# Altium project bldc_v1.PrjPcb (part 1 of 2)
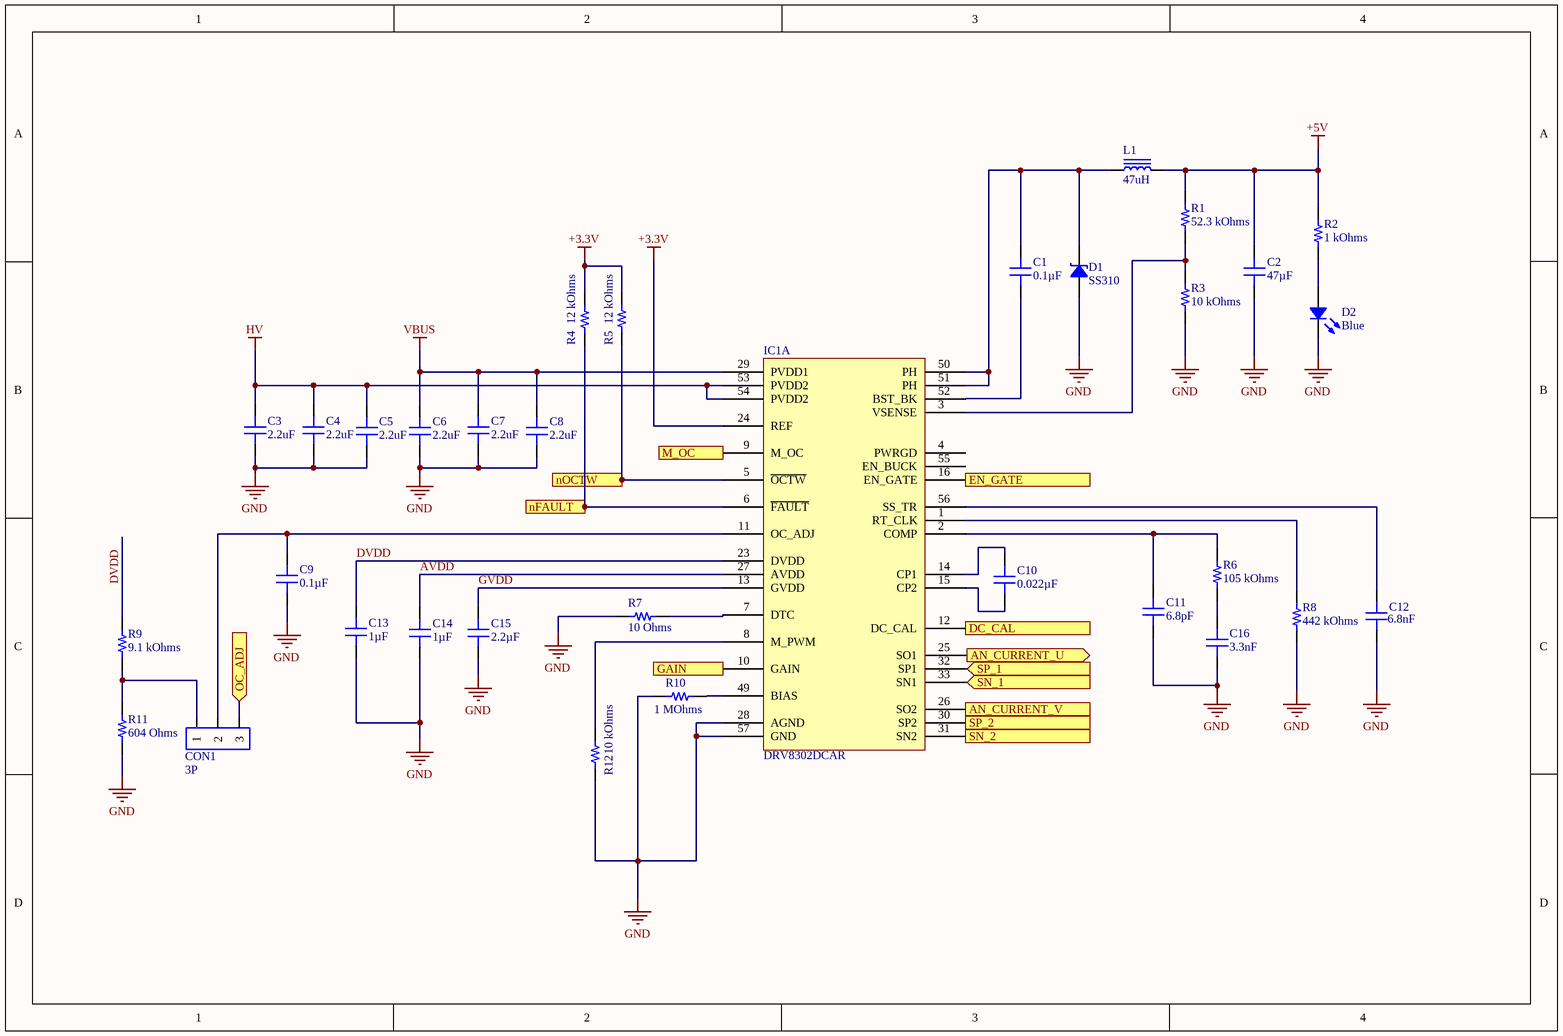
[diagram p0: driver section.SchDoc]
4 sheets, 143 parts. Net scope: flat (ports and power ports of the same name join across sheets).
Board file: main_board.PcbDoc
Sheets:
  driver section.SchDoc
  power stage.SchDoc
  controller.SchDoc
  connections.SchDoc

## Sheet driver section.SchDoc
size A4; SheetNumber: 1; SheetTotal: 4

### Parts
C1  0.1µF  [CAP 0402_1005]
C2  47µF  [CAP 1210_3225 - 2.8MM]
C3  2.2uF  [CAP FILM 1210]
C4  2.2uF  [CAP FILM 1210]
C5  2.2uF  [CAP FILM 1210]
C6  2.2uF  [CAP FILM 1210]
C7  2.2uF  [CAP FILM 1210]
C8  2.2uF  [CAP FILM 1210]
C9  0.1µF  [CAP 0402_1005]
C10  0.022µF  [CAP 0805_2012]
C11  6.8pF  [CAP 0402_1005]
C12  6.8nF  [CAP 0402_1005]
C13  1µF  [CAP 0402_1005]
C14  1µF  [CAP 0402_1005]
C15  2.2µF  [CAP 0805_2012]
C16  3.3nF  [CAP 0603_1608]
CON1  3P  [Single_THT_3P_2.54Pitch_6Height_180C]
D1  SS310  [DO214AA SMB]
D2  Blue  [LED 1206_3216 BLUE]
IC1  DRV8302DCAR  [TI HTSSOP-56 DCA]  (part A of 4)
L1  47uH  [INDP100100X45N]
R1  52.3 kOhms  [RES 1206_3216]
R2  1 kOhms  [RES 1206_3216]
R3  10 kOhms  [RES 1206_3216]
R4  12 kOhms  [RES 1206_3216]
R5  12 kOhms  [RES 1206_3216]
R6  105 kOhms  [RES 1206_3216]
R7  10 Ohms  [RES 1206_3216]
R8  442 kOhms  [RES 1206_3216]
R9  9.1 kOhms  [RES 1206_3216]
R10  1 MOhms  [RES 1206_3216]
R11  604 Ohms  [RES 1206_3216]
R12  10 kOhms  [RES 1206_3216]

### Ports
AN_CURRENT_U (out), AN_CURRENT_V (out), DC_CAL (in), EN_GATE (in), GAIN (in), M_OC (in), nFAULT (out), nOCTW (out), OC_ADJ (in), SN_1 (in), SN_2 (in), SP_1 (in), SP_2 (in)

### Nets
+3.3V: IC1.24(REF) R4.2 R5.2
+5V: C2.2 L1.2 R1.2 R2.2
GND: C2.1 C3.1 C4.1 C5.1 C6.1 C7.1 C8.1 C9.1 C11.1 C12.1 C13.1 C14.1 C15.1 C16.1 D1.1 D2.2 IC1.28(AGND) IC1.57(GND) R3.1 R7.1 R8.1 R10.2 R11.1 R12.1
HV: C3.2 C4.2 C5.2 IC1.53(PVDD2) IC1.54(PVDD2)
VBUS: C6.2 C7.2 C8.2 IC1.29(PVDD1)
AVDD: C14.2 IC1.27(AVDD)
DVDD: C13.2 IC1.23(DVDD) R9.2
GVDD: C15.2 IC1.13(GVDD)
SHUNT_1_N: IC1.32(SP1) ; port SP_1
SHUNT_1_P: IC1.33(SN1) ; port SN_1
SHUNT_2_N: IC1.30(SP2) ; port SP_2
SHUNT_2_P: IC1.31(SN2) ; port SN_2
NetC1_1: C1.1 IC1.52(BST_BK)
NetC1_2: C1.2 D1.2 IC1.50(PH) IC1.51(PH) L1.1
NetC9_2: C9.2 CON1.2 IC1.11(OC_ADJ)
NetC10_1: C10.1 IC1.15(CP2)
NetC10_2: C10.2 IC1.14(CP1)
NetC11_2: C11.2 IC1.2(COMP) R6.2
NetC12_2: C12.2 IC1.56(SS_TR)
NetC16_2: C16.2 R6.1
NetCON1_1: CON1.1 R9.1 R11.2
NetCON1_3: CON1.3 ; port OC_ADJ
NetD2_1: D2.1 R2.1
NetIC1_1: IC1.1(RT_CLK) R8.2
NetIC1_3: IC1.3(VSENSE) R1.1 R3.2
NetIC1_5: IC1.5(~{OCTW}) R5.1 ; port nOCTW
NetIC1_6: IC1.6(~{FAULT}) R4.1 ; port nFAULT
NetIC1_7: IC1.7(DTC) R7.2
NetIC1_8: IC1.8(M_PWM) R12.2
NetIC1_9: IC1.9(M_OC) ; port M_OC
NetIC1_10: IC1.10(GAIN) ; port GAIN
NetIC1_12: IC1.12(DC_CAL) ; port DC_CAL
NetIC1_16: IC1.16(EN_GATE) ; port EN_GATE
NetIC1_25: IC1.25(SO1) ; port AN_CURRENT_U
NetIC1_26: IC1.26(SO2) ; port AN_CURRENT_V
NetIC1_49: IC1.49(BIAS) R10.1

Not connected (* = marked no-connect by the designer): IC1 4(PWRGD) 55(EN_BUCK)

### Notes on the sheet
- Over Current Trip Volt=
  R2/(R1+R2)*DVDD(3.3V)
  Over Current=Vds/Rds
  Over Current Trip Current=30A

### Library data of the parts
C1 C9 = C0402C104M4RACTU: CAP CER 0.1UF 16V X7R 0402; Manufacturer: KEMET; Tolerance: ±20%; Part Number: C0402C104M4RACTU; Value: 0.1µF; Applications: Bypass, Decoupling; Capacitance: 0.1µF; ComponentLink1Description: Datasheet; ComponentLink1URL: https://api.kemet.com/component-edge/download/datasheet/C0402C104M4RACTU.pdf; ComponentLink2Description: DigiKey Link; ComponentLink2URL: http://digikey.com/product-detail/en/kemet/C0402C104M4RACTU/399-7763-1-ND/3471486; Device Package: 0402 (1005 Metric); LastUpdated: 9/2/2020 1:02:24 AM; Lifecycle Status: Active; Minimum Order: 1; Mounting Type: Surface Mount, MLCC; Operating Temperature: -55°C ~ 125°C; Package / Case: 0402 (1005 Metric); Packaging: TapeAndReel; PartId: 2095; Part Status: Active; Price: 0.02; Series: SMD Comm X7R; Size / Dimension: 0.039" L x 0.020" W (1.00mm x 0.50mm); Supplier 1: DigiKey; Supplier Part Number 1: 399-7763-1-ND; Temperature Coefficient: X7R; Thickness (Max): 0.022" (0.55mm); Voltage - Rated: 16V
C2 = GRM32EC81C476KE15L: CAP CER 47UF 16V X6S 1210; Manufacturer: Murata Electronics; Tolerance: ±10%; Part Number: GRM32EC81C476KE15L; Value: 47µF; Applications: General Purpose; Capacitance: 47µF; ComponentLink1Description: Datasheet; ComponentLink1URL: https://search.murata.co.jp/Ceramy/image/img/A01X/G101/ENG/GRM32EC81C476KE15-01.pdf; ComponentLink2Description: DigiKey Link; ComponentLink2URL: http://digikey.com/product-detail/en/murata-electronics/GRM32EC81C476KE15L/490-10531-1-ND/5026469; Device Package: 1210 (3225 Metric); LastUpdated: 9/2/2020 1:10:53 AM; Lifecycle Status: Active; Minimum Order: 1; Mounting Type: Surface Mount, MLCC; Operating Temperature: -55°C ~ 105°C; Package / Case: 1210 (3225 Metric); Packaging: TapeAndReel; PartId: 23627; Part Status: Active; Price: 0.23; Series: GRM; Size / Dimension: 0.126" L x 0.098" W (3.20mm x 2.50mm); Supplier 1: DigiKey; Supplier Part Number 1: 490-10531-1-ND; Temperature Coefficient: X6S; Thickness (Max): 0.106" (2.70mm); Voltage - Rated: 16V
C3-C8 = LDEEB2220JA0N00: CAP FILM 0.022UF 5% 100VDC 1210; Manufacturer: KEMET; Dielectric Material: Polyester, Polyethylene Naphthalate (PEN), Metallized - Stacked; Voltage Rating - AC: 63V; Voltage Rating - DC: 100V; Part Number: LDEEB2220JA0N00; Capacitance: 2.2uF; Applications: Automotive; ComponentLink1Description: Datasheet; ComponentLink1URL: https://api.kemet.com/component-edge/download/datasheet/LDEEB2220JA0N00.pdf; ComponentLink2Description: DigiKey Link; ComponentLink2URL: http://digikey.com/product-detail/en/kemet/LDEEB2220JA0N00/399-6424-1-ND/3028782; Device Package: 1210 (3225 Metric); Features: High Temperature; Height - Seated (Max): 0.059" (1.50mm); LastUpdated: 9/2/2020 1:24:46 AM; Lifecycle Status: Active; Minimum Order: 1; Mounting Type: Surface Mount; Operating Temperature: -55°C ~ 125°C; Package / Case: 1210 (3225 Metric); Packaging: TapeAndReel; Part Status: Active; Price: 0.35; Ratings: AEC-Q200; Series: LDE; Size / Dimension: 0.130" L x 0.098" W (3.30mm x 2.50mm); Supplier 1: DigiKey; Supplier Part Number 1: 399-6424-1-ND; Termination: Solder Pads; Tolerance: ±5%; Value: 2.2uF
C10 = CL21B223KCFNNNE: CAP CER 0.022UF 100V X7R 0805; Manufacturer: Samsung Electro-Mechanics; Tolerance: ±10%; Part Number: CL21B223KCFNNNE; Value: 0.022µF; Applications: General Purpose; Capacitance: 0.022µF; ComponentLink1Description: Datasheet; ComponentLink1URL: http://www.samsungsem.com/kr/support/product-search/mlcc/CL21B223KCFNNNE.jsp; ComponentLink2Description: DigiKey Link; ComponentLink2URL: http://digikey.com/product-detail/en/samsung-electro-mechanics/CL21B223KCFNNNE/1276-2942-1-ND/3891028; Device Package: 0805 (2012 Metric); LastUpdated: 9/2/2020 1:04:37 AM; Lifecycle Status: Active; Minimum Order: 1; Mounting Type: Surface Mount, MLCC; Operating Temperature: -55°C ~ 125°C; Package / Case: 0805 (2012 Metric); Packaging: TapeAndReel; PartId: 4906; Part Status: Active; Price: 0.02; Series: CL; Size / Dimension: 0.079" L x 0.049" W (2.00mm x 1.25mm); Supplier 1: DigiKey; Supplier Part Number 1: 1276-2942-1-ND; Temperature Coefficient: X7R; Thickness (Max): 0.053" (1.35mm); Voltage - Rated: 100V
C11 = C0402C689C5GACAUTO: CAP CER 6.8PF 50V C0G/NP0 0402; Manufacturer: KEMET; Temperature Coefficient: C0G, NP0; Tolerance: ±0.25pF; Part Number: C0402C689C5GACAUTO; Value: 6.8pF; Applications: Automotive; Capacitance: 6.8pF; ComponentLink1Description: Datasheet; ComponentLink1URL: https://api.kemet.com/component-edge/download/datasheet/C0402C689C5GACAUTO.pdf; ComponentLink2Description: DigiKey Link; ComponentLink2URL: http://digikey.com/product-detail/en/kemet/C0402C689C5GACAUTO/399-19383-1-ND/9694290; Device Package: 0402 (1005 Metric); Features: Low ESL; LastUpdated: 9/2/2020 1:02:25 AM; Lifecycle Status: Active; Minimum Order: 1; Mounting Type: Surface Mount, MLCC; Operating Temperature: -55°C ~ 125°C; Package / Case: 0402 (1005 Metric); Packaging: TapeAndReel; PartId: 1723; Part Status: Active; Price: 0.02; Ratings: AEC-Q200; Series: SMD Auto C0G; Size / Dimension: 0.039" L x 0.020" W (1.00mm x 0.50mm); Supplier 1: DigiKey; Supplier Part Number 1: 399-19383-1-ND; Thickness (Max): 0.022" (0.55mm); Voltage - Rated: 50V
C12 = CGA2B3X7R1H683K050BB: CAP CER 0.068UF 50V X7R 0402; Manufacturer: TDK Corporation; Tolerance: ±10%; Part Number: CGA2B3X7R1H683K050BB; Value: 6.8nF; Applications: Automotive; Capacitance: 6.8nF; ComponentLink1Description: Datasheet; ComponentLink1URL: https://product.tdk.com/info/en/catalog/datasheets/mlcc_automotive_general_en.pdf?ref_disty=digikey; ComponentLink2Description: DigiKey Link; ComponentLink2URL: http://digikey.com/product-detail/en/tdk-corporation/CGA2B3X7R1H683K050BB/445-6898-1-ND/2672916; Device Package: 0402 (1005 Metric); LastUpdated: 9/2/2020 1:02:25 AM; Lifecycle Status: Active; Minimum Order: 1; Mounting Type: Surface Mount, MLCC; Operating Temperature: -55°C ~ 125°C; Package / Case: 0402 (1005 Metric); Packaging: TapeAndReel; PartId: 1772; Part Status: Active; Price: 0.02; Ratings: AEC-Q200; Series: CGA; Size / Dimension: 0.039" L x 0.020" W (1.00mm x 0.50mm); Supplier 1: DigiKey; Supplier Part Number 1: 445-6898-1-ND; Temperature Coefficient: X7R; Thickness (Max): 0.022" (0.55mm); Voltage - Rated: 50V
C13 C14 = GRM155C71A105KE11D: CAP CER 1UF 10V X7S 0402; Manufacturer: Murata Electronics; Tolerance: ±10%; Part Number: GRM155C71A105KE11D; Value: 1µF; Applications: General Purpose; Capacitance: 1µF; ComponentLink1Description: Datasheet; ComponentLink1URL: https://search.murata.co.jp/Ceramy/image/img/A01X/G101/ENG/GRM155C71A105KE11-01.pdf; ComponentLink2Description: DigiKey Link; ComponentLink2URL: http://digikey.com/product-detail/en/murata-electronics/GRM155C71A105KE11D/490-14457-1-ND/6606918; Device Package: 0402 (1005 Metric); LastUpdated: 9/2/2020 1:02:25 AM; Lifecycle Status: Active; Minimum Order: 1; Mounting Type: Surface Mount, MLCC; Operating Temperature: -55°C ~ 125°C; Package / Case: 0402 (1005 Metric); Packaging: TapeAndReel; PartId: 1749; Part Status: Active; Price: 0.08; Series: GRM; Size / Dimension: 0.039" L x 0.020" W (1.00mm x 0.50mm); Supplier 1: DigiKey; Supplier Part Number 1: 490-14457-1-ND; Temperature Coefficient: X7S; Thickness (Max): 0.024" (0.60mm); Voltage - Rated: 10V
C15 = C2012X7R1E225M085AB: CAP CER 2.2UF 25V X7R 0805; Manufacturer: TDK Corporation; Tolerance: ±20%; Part Number: C2012X7R1E225M085AB; Value: 2.2µF; Applications: General Purpose; Capacitance: 2.2µF; ComponentLink1Description: Datasheet; ComponentLink1URL: https://product.tdk.com/info/en/catalog/datasheets/mlcc_commercial_general_en.pdf?ref_disty=digikey; ComponentLink2Description: DigiKey Link; ComponentLink2URL: http://digikey.com/product-detail/en/tdk-corporation/C2012X7R1E225M085AB/445-14536-1-ND/3956202; Device Package: 0805 (2012 Metric); Features: Low ESL; LastUpdated: 9/2/2020 1:04:41 AM; Lifecycle Status: Active; Minimum Order: 1; Mounting Type: Surface Mount, MLCC; Operating Temperature: -55°C ~ 125°C; Package / Case: 0805 (2012 Metric); Packaging: TapeAndReel; PartId: 3013; Part Status: Active; Price: 0.09; Series: C; Size / Dimension: 0.079" L x 0.049" W (2.00mm x 1.25mm); Supplier 1: DigiKey; Supplier Part Number 1: 445-14536-1-ND; Temperature Coefficient: X7R; Thickness (Max): 0.039" (1.00mm); Voltage - Rated: 25V
C16 = C0603C333K5RACAUTO: CAP CER 0.033UF 50V X7R 0603; Manufacturer: KEMET; Tolerance: ±10%; Part Number: C0603C333K5RACAUTO; Value: 3.3nF; Applications: Automotive, Bypass, Decoupling; Capacitance: 3.3nF; ComponentLink1Description: Datasheet; ComponentLink1URL: https://api.kemet.com/component-edge/download/datasheet/C0603C333K5RACAUTO.pdf; ComponentLink2Description: DigiKey Link; ComponentLink2URL: http://digikey.com/product-detail/en/kemet/C0603C333K5RACAUTO/399-6884-1-ND/3314396; Device Package: 0603 (1608 Metric); LastUpdated: 9/2/2020 1:03:36 AM; Lifecycle Status: Active; Minimum Order: 1; Mounting Type: Surface Mount, MLCC; Operating Temperature: -55°C ~ 125°C; Package / Case: 0603 (1608 Metric); Packaging: TapeAndReel; PartId: 2224; Part Status: Active; Price: 0.02; Ratings: AEC-Q200; Series: SMD Auto X7R; Size / Dimension: 0.063" L x 0.031" W (1.60mm x 0.80mm); Supplier 1: DigiKey; Supplier Part Number 1: 399-6884-1-ND; Temperature Coefficient: X7R; Thickness (Max): 0.034" (0.87mm); Voltage - Rated: 50V
CON1 = Single 3P 2.54mm
D1 = SS310: Zener Diode; Part Number: SS310
D2 = SM1206NBWC-IL: LED BLUE CLEAR 1206 SMD; Manufacturer: Bivar Inc.; Configuration: Standard; Current - Test: 20mA; Lens Color: Colorless; Lens Size: 1.10mm Dia; Lens Style: Round with Flat Top; Millicandela Rating: 950mcd; Viewing Angle: 30°; Voltage - Forward (Vf) (Typ): 3.1V; Wavelength - Dominant: 470nm; Wavelength - Peak: 468nm; Part Number: SM1206NBWC-IL; Color: Blue; ComponentLink1Description: Datasheet; ComponentLink1URL: https://www.bivar.com/Files/Datasheets/SM1206NBWC-IL.pdf; ComponentLink2Description: DigiKey Link; ComponentLink2URL: http://digikey.com/product-detail/en/bivar-inc/SM1206NBWC-IL/492-1943-1-ND/5030119; Device Package: 1206 (3216 Metric); Height (Max): 1.40mm; LastUpdated: 9/2/2020 1:20:33 AM; Lens Transparency: Clear; Lifecycle Status: Active; Minimum Order: 1; Mounting Type: Surface Mount; Package / Case: 1206 (3216 Metric); Packaging: TapeAndReel; PartId: 739; Part Status: Active; Price: 0.31; Series: -; Size / Dimension: 3.20mm L x 1.60mm W; Supplier 1: DigiKey; Supplier Part Number 1: 492-1943-1-ND; Supplier Device Package: 1206; Value: Blue
IC1 = DRV8302DCAR: IC MOTOR DRIVER 8V-60V 56HTSSOP; Manufacturer: Texas Instruments; Function: Controller - Commutation, Direction Management; Interface: Parallel; Motor Type - AC, DC: Brushless DC (BLDC); Output Configuration: Pre-Driver - Half Bridge (3); Voltage - Supply: 8V ~ 60V; Part Number: DRV8302DCAR; Applications: General Purpose; ComponentLink1Description: Datasheet; ComponentLink1URL: http://www.ti.com/general/docs/suppproductinfo.tsp?distId=10&gotoUrl=http%3A%2F%2Fwww.ti.com%2Flit%2Fgpn%2Fdrv8302; ComponentLink2Description: DigiKey Link; ComponentLink2URL: //digikey.com/product-detail/en/texas-instruments/DRV8302DCAR/296-29544-1-ND/2753591; Device Package: 56-TFSOP (0.240", 6.10mm Width) Exposed Pad; LastUpdated: 12/4/2019 1:00:33 AM; Lifecycle Status: 0; Minimum Order: 1; Mounting Type: Surface Mount; Operating Temperature: -40°C ~ 125°C (TA); Package / Case: 56-TFSOP (0.240", 6.10mm Width) Exposed Pad; Packaging: CutTape; PartId: 6; Part Status: Active; Price: 6.00; Series: -; Supplier 1: DigiKey; Supplier Part Number 1: 296-29544-1-ND; Supplier Device Package: 56-HTSSOP; Technology: Power MOSFET
L1 = SRI1004-470M: SMT Inductor; Value: 47uH
R1 = RC1206FR-0752K3L: RES SMD 52.3K OHM 1% 1/4W 1206; Manufacturer: Yageo; Power (Watts): 0.25W, 1/4W; Temperature Coefficient: ±100ppm/°C; Part Number: RC1206FR-0752K3L; ComponentLink1Description: Datasheet; ComponentLink1URL: https://www.yageo.com/upload/media/product/productsearch/datasheet/rchip/PYu-RC_Group_51_RoHS_L_10.pdf; ComponentLink2Description: DigiKey Link; ComponentLink2URL: http://digikey.com/product-detail/en/yageo/RC1206FR-0752K3L/311-52.3KFRCT-ND/731929; Composition: Thick Film; Device Package: 1206 (3216 Metric); Features: Moisture Resistant; Height - Seated (Max): 0.026" (0.65mm); LastUpdated: 9/2/2020 1:12:48 AM; Lifecycle Status: Active; Minimum Order: 1; Number of Terminations: 2; Operating Temperature: -55°C ~ 155°C; Package / Case: 1206 (3216 Metric); Packaging: TapeAndReel; PartId: 35877; Part Status: Active; Price: 0.01; Resistance: 52.3 kOhms; Series: RC; Size / Dimension: 0.122" L x 0.063" W (3.10mm x 1.60mm); Supplier 1: DigiKey; Supplier Part Number 1: 311-52.3KFRCT-ND; Supplier Device Package: 1206; Tolerance: ±1%; Value: 52.3 kOhms
R2 = RC1206FR-071KL: RES SMD 1K OHM 1% 1/4W 1206; Manufacturer: Yageo; Power (Watts): 0.25W, 1/4W; Temperature Coefficient: ±100ppm/°C; Part Number: RC1206FR-071KL; ComponentLink1Description: Datasheet; ComponentLink1URL: https://www.yageo.com/upload/media/product/productsearch/datasheet/rchip/PYu-RC_Group_51_RoHS_L_10.pdf; ComponentLink2Description: DigiKey Link; ComponentLink2URL: http://digikey.com/product-detail/en/yageo/RC1206FR-071KL/311-1.00KFRCT-ND/731334; Composition: Thick Film; Device Package: 1206 (3216 Metric); Features: Moisture Resistant; Height - Seated (Max): 0.026" (0.65mm); LastUpdated: 9/2/2020 1:13:10 AM; Lifecycle Status: Active; Minimum Order: 1; Number of Terminations: 2; Operating Temperature: -55°C ~ 155°C; Package / Case: 1206 (3216 Metric); Packaging: TapeAndReel; PartId: 26978; Part Status: Active; Price: 0.01; Resistance: 1 kOhms; Series: RC; Size / Dimension: 0.122" L x 0.063" W (3.10mm x 1.60mm); Supplier 1: DigiKey; Supplier Part Number 1: 311-1.00KFRCT-ND; Supplier Device Package: 1206; Tolerance: ±1%; Value: 1 kOhms
R3 R12 = CRG1206F10K: RES SMD 10K OHM 1% 1/4W 1206; Manufacturer: TE Connectivity Passive Product; Power (Watts): 0.25W, 1/4W; Temperature Coefficient: ±100ppm/°C; Part Number: CRG1206F10K; ComponentLink1Description: Datasheet; ComponentLink1URL: https://www.te.com/commerce/DocumentDelivery/DDEController?Action=srchrtrv&DocNm=1773204&DocType=DS&DocLang=English; ComponentLink2Description: DigiKey Link; ComponentLink2URL: http://digikey.com/product-detail/en/te-connectivity-passive-product/CRG1206F10K/A106069CT-ND/3477720; Composition: Thick Film; Device Package: 1206 (3216 Metric); Height - Seated (Max): 0.026" (0.65mm); LastUpdated: 9/2/2020 1:13:10 AM; Lifecycle Status: Active; Minimum Order: 1; Number of Terminations: 2; Operating Temperature: -55°C ~ 155°C; Package / Case: 1206 (3216 Metric); Packaging: TapeAndReel; PartId: 26989; Part Status: Active; Price: 0.01; Resistance: 10 kOhms; Series: CRG, Neohm; Size / Dimension: 0.122" L x 0.061" W (3.10mm x 1.55mm); Supplier 1: DigiKey; Supplier Part Number 1: A106069CT-ND; Supplier Device Package: 1206; Tolerance: ±1%; Value: 10 kOhms
R4 R5 = RMCF1206FT12K0: RES 12K OHM 1% 1/4W 1206; Manufacturer: Stackpole Electronics Inc; Power (Watts): 0.25W, 1/4W; Temperature Coefficient: ±100ppm/°C; Part Number: RMCF1206FT12K0; ComponentLink1Description: Datasheet; ComponentLink1URL: https://www.seielect.com/catalog/sei-rmcf_rmcp.pdf; ComponentLink2Description: DigiKey Link; ComponentLink2URL: http://digikey.com/product-detail/en/stackpole-electronics-inc/RMCF1206FT12K0/RMCF1206FT12K0CT-ND/2418564; Composition: Thick Film; Device Package: 1206 (3216 Metric); Features: Automotive AEC-Q200; Height - Seated (Max): 0.028" (0.70mm); LastUpdated: 9/2/2020 1:13:11 AM; Lifecycle Status: Active; Minimum Order: 1; Number of Terminations: 2; Operating Temperature: -55°C ~ 155°C; Package / Case: 1206 (3216 Metric); Packaging: CutTape; PartId: 26918; Part Status: Active; Price: 0.10; Ratings: AEC-Q200; Resistance: 12 kOhms; Series: RMCF; Size / Dimension: 0.126" L x 0.063" W (3.20mm x 1.60mm); Supplier 1: DigiKey; Supplier Part Number 1: RMCF1206FT12K0CT-ND; Supplier Device Package: 1206; Tolerance: ±1%; Value: 12 kOhms
R6 = RC1206FR-07105KL: RES SMD 105K OHM 1% 1/4W 1206; Manufacturer: Yageo; Power (Watts): 0.25W, 1/4W; Temperature Coefficient: ±100ppm/°C; Part Number: RC1206FR-07105KL; ComponentLink1Description: Datasheet; ComponentLink1URL: https://www.yageo.com/upload/media/product/productsearch/datasheet/rchip/PYu-RC_Group_51_RoHS_L_10.pdf; ComponentLink2Description: DigiKey Link; ComponentLink2URL: http://digikey.com/product-detail/en/yageo/RC1206FR-07105KL/311-105KFRCT-ND/731443; Composition: Thick Film; Device Package: 1206 (3216 Metric); Features: Moisture Resistant; Height - Seated (Max): 0.026" (0.65mm); LastUpdated: 9/2/2020 1:12:56 AM; Lifecycle Status: Active; Minimum Order: 1; Number of Terminations: 2; Operating Temperature: -55°C ~ 155°C; Package / Case: 1206 (3216 Metric); Packaging: TapeAndReel; PartId: 32575; Part Status: Active; Price: 0.01; Resistance: 105 kOhms; Series: RC; Size / Dimension: 0.122" L x 0.063" W (3.10mm x 1.60mm); Supplier 1: DigiKey; Supplier Part Number 1: 311-105KFRCT-ND; Supplier Device Package: 1206; Tolerance: ±1%; Value: 105 kOhms
R7 = CRGCQ1206F10R: CRGCQ 1206 10R 1%; Manufacturer: TE Connectivity Passive Product; Power (Watts): 0.25W, 1/4W; Temperature Coefficient: ±400ppm/°C; Part Number: CRGCQ1206F10R; ComponentLink1Description: Datasheet; ComponentLink1URL: https://www.te.com/commerce/DocumentDelivery/DDEController?Action=srchrtrv&DocNm=1773204-3&DocType=DS&DocLang=English; ComponentLink2Description: DigiKey Link; ComponentLink2URL: http://digikey.com/product-detail/en/te-connectivity-passive-product/CRGCQ1206F10R/A129786CT-ND/8577618; Composition: Thick Film; Device Package: 1206 (3216 Metric); Features: Automotive AEC-Q200, Moisture Resistant; Height - Seated (Max): 0.026" (0.65mm); LastUpdated: 9/2/2020 1:13:10 AM; Lifecycle Status: Active; Minimum Order: 1; Number of Terminations: 2; Operating Temperature: -55°C ~ 155°C; Package / Case: 1206 (3216 Metric); Packaging: TapeAndReel; PartId: 27003; Part Status: Active; Price: 0.01; Ratings: AEC-Q200; Resistance: 10 Ohms; Series: CRGCQ; Size / Dimension: 0.122" L x 0.061" W (3.10mm x 1.55mm); Supplier 1: DigiKey; Supplier Part Number 1: A129786CT-ND; Supplier Device Package: 1206; Tolerance: ±1%; Value: 10 Ohms
R8 = CRCW1206442KFKEA: RES SMD 442K OHM 1% 1/4W 1206; Manufacturer: Vishay Dale; Power (Watts): 0.25W, 1/4W; Temperature Coefficient: ±100ppm/°C; Part Number: CRCW1206442KFKEA; ComponentLink1Description: Datasheet; ComponentLink1URL: http://www.vishay.com/docs/20035/dcrcwe3.pdf; ComponentLink2Description: DigiKey Link; ComponentLink2URL: http://digikey.com/product-detail/en/vishay-dale/CRCW1206442KFKEA/541-442KFCT-ND/1182061; Composition: Thick Film; Device Package: 1206 (3216 Metric); Features: Automotive AEC-Q200; Height - Seated (Max): 0.024" (0.60mm); LastUpdated: 9/2/2020 1:13:01 AM; Lifecycle Status: Active; Minimum Order: 1; Number of Terminations: 2; Operating Temperature: -55°C ~ 155°C; Package / Case: 1206 (3216 Metric); Packaging: TapeAndReel; PartId: 30235; Part Status: Active; Price: 0.01; Ratings: AEC-Q200; Resistance: 442 kOhms; Series: CRCW; Size / Dimension: 0.126" L x 0.063" W (3.20mm x 1.60mm); Supplier 1: DigiKey; Supplier Part Number 1: 541-442KFCT-ND; Supplier Device Package: 1206; Tolerance: ±1%; Value: 442 kOhms
R9 = RK73H2BTTD9101F: RES 9.1K OHM 1% 1/4W 1206; Manufacturer: KOA Speer Electronics, Inc.; Power (Watts): 0.25W, 1/4W; Temperature Coefficient: ±100ppm/°C; Part Number: RK73H2BTTD9101F; ComponentLink1Description: Datasheet; ComponentLink1URL: http://www.koaspeer.com/catimages/Products/RK73H/RK73H.pdf; ComponentLink2Description: DigiKey Link; ComponentLink2URL: http://digikey.com/product-detail/en/koa-speer-electronics-inc/RK73H2BTTD9101F/2019-RK73H2BTTD9101FCT-ND/10237691; Composition: Thick Film; Device Package: 1206 (3216 Metric); Features: Automotive AEC-Q200, Moisture Resistant; Height - Seated (Max): 0.028" (0.70mm); LastUpdated: 9/2/2020 1:13:09 AM; Lifecycle Status: Active; Minimum Order: 1; Number of Terminations: 2; Operating Temperature: -55°C ~ 155°C; Package / Case: 1206 (3216 Metric); Packaging: TapeAndReel; PartId: 27235; Part Status: Active; Price: 0.01; Ratings: AEC-Q200; Resistance: 9.1 kOhms; Series: RK73H; Size / Dimension: 0.126" L x 0.063" W (3.20mm x 1.60mm); Supplier 1: DigiKey; Supplier Part Number 1: 2019-RK73H2BTTD9101FCT-ND; Supplier Device Package: 1206; Tolerance: ±1%; Value: 9.1 kOhms
R10 = CRG1206F1M0: RES SMD 1M OHM 1% 1/4W 1206; Manufacturer: TE Connectivity Passive Product; Power (Watts): 0.25W, 1/4W; Temperature Coefficient: ±100ppm/°C; Part Number: CRG1206F1M0; ComponentLink1Description: Datasheet; ComponentLink1URL: https://www.te.com/commerce/DocumentDelivery/DDEController?Action=srchrtrv&DocNm=1773204&DocType=DS&DocLang=English; ComponentLink2Description: DigiKey Link; ComponentLink2URL: http://digikey.com/product-detail/en/te-connectivity-passive-product/CRG1206F1M0/A106072CT-ND/3477725; Composition: Thick Film; Device Package: 1206 (3216 Metric); Height - Seated (Max): 0.026" (0.65mm); LastUpdated: 9/2/2020 1:13:10 AM; Lifecycle Status: Active; Minimum Order: 1; Number of Terminations: 2; Operating Temperature: -55°C ~ 155°C; Package / Case: 1206 (3216 Metric); Packaging: TapeAndReel; PartId: 26984; Part Status: Active; Price: 0.01; Resistance: 1 MOhms; Series: CRG, Neohm; Size / Dimension: 0.122" L x 0.061" W (3.10mm x 1.55mm); Supplier 1: DigiKey; Supplier Part Number 1: A106072CT-ND; Supplier Device Package: 1206; Tolerance: ±1%; Value: 1 MOhms
R11 = KTR18EZPF6040: RES SMD 604 OHM 1% 1/4W 1206; Manufacturer: Rohm Semiconductor; Power (Watts): 0.25W, 1/4W; Temperature Coefficient: ±100ppm/°C; Part Number: KTR18EZPF6040; ComponentLink1Description: Datasheet; ComponentLink1URL: https://www.rohm.com/datasheet/KTR03EZPF/ktr-e; ComponentLink2Description: DigiKey Link; ComponentLink2URL: http://digikey.com/product-detail/en/rohm-semiconductor/KTR18EZPF6040/RHM604AICT-ND/4055151; Composition: Thick Film; Device Package: 1206 (3216 Metric); Features: Automotive AEC-Q200, High Voltage; Height - Seated (Max): 0.026" (0.65mm); LastUpdated: 9/2/2020 1:12:48 AM; Lifecycle Status: Active; Minimum Order: 1; Number of Terminations: 2; Operating Temperature: -55°C ~ 155°C; Package / Case: 1206 (3216 Metric); Packaging: TapeAndReel; PartId: 36254; Part Status: Active; Price: 0.02; Ratings: AEC-Q200; Resistance: 604 Ohms; Series: KTR; Size / Dimension: 0.126" L x 0.063" W (3.20mm x 1.60mm); Supplier 1: DigiKey; Supplier Part Number 1: RHM604AICT-ND; Supplier Device Package: 1206; Tolerance: ±1%; Value: 604 Ohms

## Sheet power stage.SchDoc
size A4; SheetNumber: 2; SheetTotal: 4
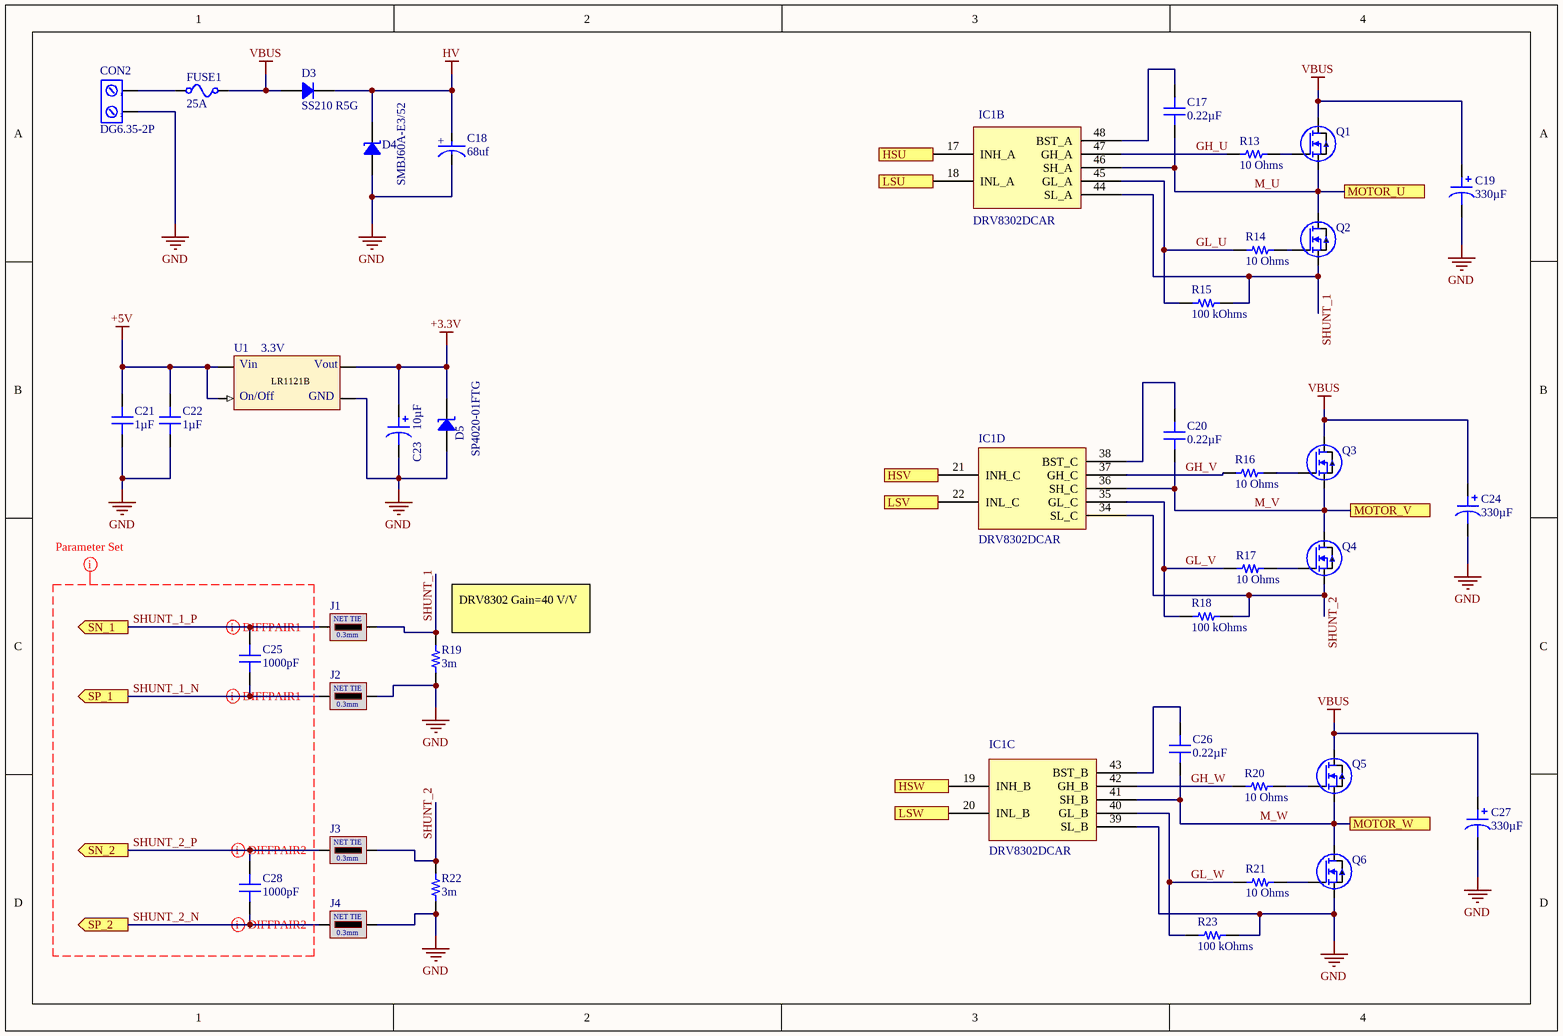
[diagram p1: power stage.SchDoc]

### Parts
C17  0.22µF  [CAP 0603_1608]
C18  68uf  [10x10 radial smd cap]
C19  330µF  [CAP TH ALUM ELEC D10.00mm S5.00mm H26.50mm]
C20  0.22µF  [CAP 0603_1608]
C21  1µF  [CAP 0402_1005]
C22  1µF  [CAP 0402_1005]
C23  10µF  [CAP POL 1206_3216]
C24  330µF  [CAP TH ALUM ELEC D10.00mm S5.00mm H26.50mm]
C25  1000pF  [CAP 0805_2012]
C26  0.22µF  [CAP 0603_1608]
C27  330µF  [CAP TH ALUM ELEC D10.00mm S5.00mm H26.50mm]
C28  1000pF  [CAP 0805_2012]
CON2  DG6.35-2P  [DG636-6.35-2P]
D3  SS210 R5G  [DO214AA SMB]
D4  SMBJ60A-E3/52  [DO214AA SMB]
D5  SP4020-01FTG  [SOD323]
FUSE1  25A  [3522 ATOF FUSE]
IC1  DRV8302DCAR  [TI HTSSOP-56 DCA]  (parts B,C,D of 4)
J1  NET TIE 1  [net_tie_03mm]  (value not drawn)  (net tie, no BOM)
J2  NET TIE 1  [net_tie_03mm]  (value not drawn)  (net tie, no BOM)
J3  NET TIE 1  [net_tie_03mm]  (value not drawn)  (net tie, no BOM)
J4  NET TIE 1  [net_tie_03mm]  (value not drawn)  (net tie, no BOM)
Q1  STB100N10F7  [D2PAK]  (value not drawn)
Q2  STB100N10F7  [D2PAK]  (value not drawn)
Q3  STB100N10F7  [D2PAK]  (value not drawn)
Q4  STB100N10F7  [D2PAK]  (value not drawn)
Q5  STB100N10F7  [D2PAK]  (value not drawn)
Q6  STB100N10F7  [D2PAK]  (value not drawn)
R13  10 Ohms  [RES 1206_3216]
R14  10 Ohms  [RES 1206_3216]
R15  100 kOhms  [RES 1206_3216]
R16  10 Ohms  [RES 1206_3216]
R17  10 Ohms  [RES 1206_3216]
R18  100 kOhms  [RES 1206_3216]
R19  3m  [2512_bvt]
R20  10 Ohms  [RES 1206_3216]
R21  10 Ohms  [RES 1206_3216]
R22  3m  [2512_bvt]
R23  100 kOhms  [RES 1206_3216]
U1  3.3V  [SOT25_LR2111]

### Ports
HSU (in), HSV (in), HSW (in), LSU (in), LSV (in), LSW (in), MOTOR_U, MOTOR_V, MOTOR_W, SN_1 (out), SN_2 (out), SP_1 (out), SP_2 (out)

### Nets
+3.3V: C23.1 D5.2 U1.1(Vout)
+5V: C21.2 C22.2 U1.3(Vin) U1.4(ON/OFF)
GND: C18.1(C) C19.2 C21.1 C22.1 C23.2 C24.2 C27.2 CON2.2 D4.1 D5.1 IC1.39(SL_B) J2.2 J4.2 Q6.3(S) R19.1 R22.1 R23.2 U1.2(Vss)
HV: C18.2(A) D3.2 D4.2
VBUS: C19.1 C24.1 C27.1 D3.1 FUSE1.2 Q1.2(D) Q3.2(D) Q5.2(D)
GH_U: IC1.47(GH_A) R13.1
GH_V: IC1.37(GH_C) R16.1
GH_W: IC1.42(GH_B) R20.1
GL_U: IC1.45(GL_A) R14.1 R15.1
GL_V: IC1.35(GL_C) R17.1 R18.1
GL_W: IC1.40(GL_B) R21.1 R23.1
M_U: C17.1 IC1.46(SH_A) Q1.3(S) Q2.2(D) ; port MOTOR_U
M_V: C20.1 IC1.36(SH_C) Q3.3(S) Q4.2(D) ; port MOTOR_V
M_W: C26.1 IC1.41(SH_B) Q5.3(S) Q6.2(D) ; port MOTOR_W
SHUNT_1: IC1.44(SL_A) J1.2 Q2.3(S) R15.2 R19.2
SHUNT_1_N: C25.1 J2.1 ; port SP_1
SHUNT_1_P: C25.2 J1.1 ; port SN_1
SHUNT_2: IC1.34(SL_C) J3.2 Q4.3(S) R18.2 R22.2
SHUNT_2_N: C28.1 J4.1 ; port SP_2
SHUNT_2_P: C28.2 J3.1 ; port SN_2
NetC17_2: C17.2 IC1.48(BST_A)
NetC20_2: C20.2 IC1.38(BST_C)
NetC26_2: C26.2 IC1.43(BST_B)
NetCON2_1: CON2.1 FUSE1.1
NetIC1_17: IC1.17(INH_A) ; port HSU
NetIC1_18: IC1.18(INL_A) ; port LSU
NetIC1_19: IC1.19(INH_B) ; port HSW
NetIC1_20: IC1.20(INL_B) ; port LSW
NetIC1_21: IC1.21(INH_C) ; port HSV
NetIC1_22: IC1.22(INL_C) ; port LSV
NetQ1_1: Q1.1(G) R13.2
NetQ2_1: Q2.1(G) R14.2
NetQ3_1: Q3.1(G) R16.2
NetQ4_1: Q4.1(G) R17.2
NetQ5_1: Q5.1(G) R20.2
NetQ6_1: Q6.1(G) R21.2

### Layout directives
differential pair; differential pair class SHUNT: SHUNT_1_N, SHUNT_1_P, SHUNT_2_N, SHUNT_2_P
net class diff_pair; rule Clearance Constraint [Clearance = 0.15mm]; rule Width Constraint [Pref Width = 0.3mm    Min Width = 0.2mm    Max Width = 0.5mm]: SHUNT_1_N, SHUNT_1_P, SHUNT_2_N, SHUNT_2_P

### Notes on the sheet
- (near R19) DRV8302 Gain=40 V/V
- (in symbol LR1121B_3V3) LR1121B; On/Off; GND
- (in symbol NET TIE 1) NET TIE; 0.3mm
- (in symbol SC1J686M10010VR) +

### Library data of the parts
C17 C20 C26 = C0603C224K4RECAUTO: CAP CER 0603 220NF 16V X7R 10%; Manufacturer: KEMET; Part Number: C0603C224K4RECAUTO; Value: 0.22µF; Applications: Automotive, ESD Protection; Capacitance: 0.22µF; ComponentLink1Description: Datasheet; ComponentLink1URL: https://api.kemet.com/component-edge/download/datasheet/C0603C224K4RECAUTO.pdf; ComponentLink2Description: DigiKey Link; ComponentLink2URL: http://digikey.com/product-detail/en/kemet/C0603C224K4RECAUTO/399-17882-1-ND/8640549; Device Package: 0603 (1608 Metric); LastUpdated: 9/2/2020 1:03:11 AM; Lifecycle Status: Active; Minimum Order: 1; Mounting Type: Surface Mount, MLCC; Operating Temperature: -55°C ~ 125°C; Package / Case: 0603 (1608 Metric); Packaging: TapeAndReel; PartId: 15101; Part Status: Active; Price: 0.03; Ratings: AEC-Q200; Series: ESD SMD Auto X7R; Size / Dimension: 0.063" L x 0.031" W (1.60mm x 0.80mm); Supplier 1: DigiKey; Supplier Part Number 1: 399-17882-1-ND; Temperature Coefficient: X7R; Thickness (Max): 0.034" (0.87mm); Tolerance: ±10%; Voltage - Rated: 16V
C18 = SC1J686M10010VR: 68uf 100V 85C; Value: 68uf; Voltage Rating: 100V
C19 C24 C27 = UHW1J331MPD: 63V 331UF 20% HIGH RELIA-LEADED; Manufacturer: Nichicon; Impedance: 72 mOhms; Lifetime @ Temp.: 10000 Hrs @ 105°C; Polarization: Polar; Ripple Current @ High Frequency: 1.99A @ 100kHz; Ripple Current @ Low Frequency: 995mA @ 120Hz; Part Number: UHW1J331MPD; Applications: General Purpose; Capacitance: 330µF; ComponentLink1Description: Datasheet; ComponentLink1URL: http://nichicon-us.com/english/products/pdfs/e-uhw.pdf; ComponentLink2Description: DigiKey Link; ComponentLink2URL: http://digikey.com/product-detail/en/nichicon/UHW1J331MPD/493-17830-ND/9452764; Device Package: Radial, Can; Height - Seated (Max): 1.043" (26.50mm); LastUpdated: 9/2/2020 1:31:44 AM; Lead Spacing: 0.197" (5.00mm); Lifecycle Status: Active; Minimum Order: 1; Mounting Type: Through Hole; Operating Temperature: -40°C ~ 105°C; Package / Case: Radial, Can; Packaging: Bulk; PartId: 13434; Part Status: Active; Price: 1.03; Series: UHW; Size / Dimension: 0.394" Dia (10.00mm); Supplier 1: DigiKey; Supplier Part Number 1: 493-17830-ND; Tolerance: ±20%; Value: 330µF; Voltage - Rated: 63V
C21 C22 = GRM155C71A105KE11D: as C13 on sheet driver section; Part Number: GRM155C71A105KE11D; Value: 1µF; Applications: General Purpose; Capacitance: 1µF; ComponentLink1Description: Datasheet; ComponentLink1URL: https://search.murata.co.jp/Ceramy/image/img/A01X/G101/ENG/GRM155C71A105KE11-01.pdf; ComponentLink2Description: DigiKey Link; ComponentLink2URL: http://digikey.com/product-detail/en/murata-electronics/GRM155C71A105KE11D/490-14457-1-ND/6606918; Device Package: 0402 (1005 Metric); LastUpdated: 9/2/2020 1:02:25 AM; Lifecycle Status: Active; Minimum Order: 1; Mounting Type: Surface Mount, MLCC; Operating Temperature: -55°C ~ 125°C; Package / Case: 0402 (1005 Metric); Packaging: TapeAndReel; PartId: 1749; Part Status: Active; Price: 0.08; Series: GRM; Size / Dimension: 0.039" L x 0.020" W (1.00mm x 0.50mm); Supplier 1: DigiKey; Supplier Part Number 1: 490-14457-1-ND; Temperature Coefficient: X7S; Thickness (Max): 0.024" (0.60mm); Voltage - Rated: 10V
C23 = T491S106K010AT: CAP TANT 10UF 10% 10V 1206; Manufacturer: KEMET; Manufacturer Size Code: S; ESR (Equivalent Series Resistance): 15Ohm; Lifetime @ Temp.: 2000 Hrs @ 125°C; Type: Molded; Part Number: T491S106K010AT; Value: 10µF; Capacitance: 10µF; ComponentLink1Description: Datasheet; ComponentLink1URL: https://api.kemet.com/component-edge/download/datasheet/T491S106K010AT.pdf; ComponentLink2Description: DigiKey Link; ComponentLink2URL: http://digikey.com/product-detail/en/kemet/T491S106K010AT/399-9747-1-ND/3724860; Device Package: 1206 (3216 Metric); Features: General Purpose; Height - Seated (Max): 0.047" (1.20mm); LastUpdated: 9/2/2020 1:15:59 AM; Lifecycle Status: Active; Minimum Order: 1; Mounting Type: Surface Mount; Operating Temperature: -55°C ~ 125°C; Package / Case: 1206 (3216 Metric); Packaging: TapeAndReel; PartId: 113; Part Status: Active; Price: 0.48; Series: T491; Size / Dimension: 0.126" L x 0.063" W (3.20mm x 1.60mm); Supplier 1: DigiKey; Supplier Part Number 1: 399-9747-1-ND; Tolerance: ±10%; Voltage - Rated: 10V
C25 C28 = CC0805JRX7R0BB102: CAP CER 1000PF 100V X7R 0805; Manufacturer: Yageo; Tolerance: ±5%; Part Number: CC0805JRX7R0BB102; Value: 1000pF; Applications: General Purpose; Capacitance: 1000pF; ComponentLink1Description: Datasheet; ComponentLink1URL: http://www.yageo.com/documents/recent/UPY-NP0X7R_MV_100-to-630V_21.pdf; ComponentLink2Description: DigiKey Link; ComponentLink2URL: http://digikey.com/product-detail/en/yageo/CC0805JRX7R0BB102/311-1856-1-ND/5195758; Device Package: 0805 (2012 Metric); LastUpdated: 9/2/2020 1:04:42 AM; Lifecycle Status: Active; Minimum Order: 1; Mounting Type: Surface Mount, MLCC; Operating Temperature: -55°C ~ 125°C; Package / Case: 0805 (2012 Metric); Packaging: TapeAndReel; PartId: 2555; Part Status: Active; Price: 0.02; Series: CC; Size / Dimension: 0.079" L x 0.049" W (2.00mm x 1.25mm); Supplier 1: DigiKey; Supplier Part Number 1: 311-1856-1-ND; Temperature Coefficient: X7R; Thickness (Max): 0.028" (0.70mm); Voltage - Rated: 100V
D3 = SS210 R5G: DIODE SCHOTTKY 100V 2A DO214AA; Manufacturer: Taiwan Semiconductor Corporation; Current - Reverse Leakage @ Vr: 100µA @ 100V; Speed: Fast Recovery =< 500ns, > 200mA (Io); Voltage - Forward (Vf) (Max) @ If: 850mV @ 2A; Part Number: SS210 R5G; ComponentLink1Description: Datasheet; ComponentLink1URL: https://www.taiwansemi.com/products/datasheet/SS22%20SERIES_L1705.pdf; ComponentLink2Description: DigiKey Link; ComponentLink2URL: http://digikey.com/product-detail/en/taiwan-semiconductor-corporation/SS210-R5G/SS210R5GCT-ND/7359490; Current - Average Rectified (Io): 2A; Diode Type: Schottky; LastUpdated: 9/2/2020 1:18:53 AM; Lifecycle Status: Active; Minimum Order: 1; Mounting Type: Surface Mount; Operating Temperature - Junction: -55°C ~ 150°C; Package / Case: DO-214AA, SMB; Packaging: TapeAndReel; PartId: 1405; Part Status: Active; Price: 0.17; Series: -; Supplier 1: DigiKey; Supplier Part Number 1: SS210R5GCT-ND; Supplier Device Package: DO-214AA (SMB); Voltage - DC Reverse (Vr) (Max): 100V
D4 = SMBJ60A-E3/52: TVS DIODE 60V 96.8V DO214AA; Manufacturer: Vishay Semiconductor Diodes Division; Current - Peak Pulse (10/1000µs): 6.2A; Power Line Protection: No; Power - Peak Pulse: 600W; Type: Zener; Unidirectional Channels: 1; Voltage - Breakdown (Min): 66.7V; Part Number: SMBJ60A-E3/52; Applications: General Purpose; ComponentLink1Description: Datasheet; ComponentLink1URL: http://www.vishay.com/docs/88392/smbj.pdf; ComponentLink2Description: DigiKey Link; ComponentLink2URL: http://digikey.com/product-detail/en/vishay-semiconductor-diodes-division/SMBJ60A-E3-52/SMBJ60A-E3-52GICT-ND/2413480; LastUpdated: 9/2/2020 1:19:51 AM; Lifecycle Status: Active; Minimum Order: 1; Mounting Type: Surface Mount; Operating Temperature: -55°C ~ 150°C (TJ); Package / Case: DO-214AA, SMB; Packaging: TapeAndReel; PartId: 11384; Part Status: Active; Price: 0.15; Series: TransZorb®; Supplier 1: DigiKey; Supplier Part Number 1: SMBJ60A-E3/52GICT-ND; Supplier Device Package: DO-214AA (SMBJ); Voltage - Clamping (Max) @ Ipp: 96.8V; Voltage - Reverse Standoff (Typ): 60V
D5 = SP4020-01FTG: TVS DIODE 3.3V 21.8V SOD323; Manufacturer: Littelfuse Inc.; Capacitance @ Frequency: 2.5pF @ 1MHz; Current - Peak Pulse (10/1000µs): 30A (8/20µs); Power Line Protection: No; Power - Peak Pulse: 750W; Type: Steering (Rail to Rail); Unidirectional Channels: 1; Voltage - Breakdown (Min): 3.5V; Voltage - Clamping (Max) @ Ipp: 21.8V (Typ); Voltage - Reverse Standoff (Typ): 3.3V (Max); Part Number: SP4020-01FTG; Applications: Ethernet; ComponentLink1Description: Datasheet; ComponentLink1URL: https://www.littelfuse.com/~/media/electronics/datasheets/tvs_diode_arrays/littelfuse_tvs_diode_array_sp4020_datasheet.pdf.pdf; ComponentLink2Description: DigiKey Link; ComponentLink2URL: http://digikey.com/product-detail/en/littelfuse-inc/SP4020-01FTG/F6270CT-ND/4579604; LastUpdated: 9/2/2020 1:28:27 AM; Lifecycle Status: Active; Minimum Order: 1; Mounting Type: Surface Mount; Operating Temperature: -40°C ~ 125°C (TJ); Package / Case: SC-76, SOD-323; Packaging: TapeAndReel; PartId: 9868; Part Status: Active; Price: 0.22; Series: SP4020, SPA®; Supplier 1: DigiKey; Supplier Part Number 1: F6270CT-ND; Supplier Device Package: SOD-323
FUSE1 = ATOF Fuse 3522: 3522 ATOF automotive fuse; Value: 25A
IC1 = DRV8302DCAR: as IC1 on sheet driver section; Part Number: DRV8302DCAR; Applications: General Purpose; ComponentLink1Description: Datasheet; ComponentLink1URL: http://www.ti.com/general/docs/suppproductinfo.tsp?distId=10&gotoUrl=http%3A%2F%2Fwww.ti.com%2Flit%2Fgpn%2Fdrv8302; ComponentLink2Description: DigiKey Link; ComponentLink2URL: //digikey.com/product-detail/en/texas-instruments/DRV8302DCAR/296-29544-1-ND/2753591; Device Package: 56-TFSOP (0.240", 6.10mm Width) Exposed Pad; LastUpdated: 12/4/2019 1:00:33 AM; Lifecycle Status: 0; Minimum Order: 1; Mounting Type: Surface Mount; Operating Temperature: -40°C ~ 125°C (TA); Package / Case: 56-TFSOP (0.240", 6.10mm Width) Exposed Pad; Packaging: CutTape; PartId: 6; Part Status: Active; Price: 6.00; Series: -; Supplier 1: DigiKey; Supplier Part Number 1: 296-29544-1-ND; Supplier Device Package: 56-HTSSOP; Technology: Power MOSFET
R13 R14 R16 R17 R20 R21 = CRGCQ1206F10R: as R7 on sheet driver section; Part Number: CRGCQ1206F10R; ComponentLink1Description: Datasheet; ComponentLink1URL: https://www.te.com/commerce/DocumentDelivery/DDEController?Action=srchrtrv&DocNm=1773204-3&DocType=DS&DocLang=English; ComponentLink2Description: DigiKey Link; ComponentLink2URL: http://digikey.com/product-detail/en/te-connectivity-passive-product/CRGCQ1206F10R/A129786CT-ND/8577618; Composition: Thick Film; Device Package: 1206 (3216 Metric); Features: Automotive AEC-Q200, Moisture Resistant; Height - Seated (Max): 0.026" (0.65mm); LastUpdated: 9/2/2020 1:13:10 AM; Lifecycle Status: Active; Minimum Order: 1; Number of Terminations: 2; Operating Temperature: -55°C ~ 155°C; Package / Case: 1206 (3216 Metric); Packaging: TapeAndReel; PartId: 27003; Part Status: Active; Price: 0.01; Ratings: AEC-Q200; Resistance: 10 Ohms; Series: CRGCQ; Size / Dimension: 0.122" L x 0.061" W (3.10mm x 1.55mm); Supplier 1: DigiKey; Supplier Part Number 1: A129786CT-ND; Supplier Device Package: 1206; Tolerance: ±1%; Value: 10 Ohms
R15 R18 R23 = CRG1206F100K: RES SMD 100K OHM 1% 1/4W 1206; Manufacturer: TE Connectivity Passive Product; Power (Watts): 0.25W, 1/4W; Temperature Coefficient: ±100ppm/°C; Part Number: CRG1206F100K; ComponentLink1Description: Datasheet; ComponentLink1URL: https://www.te.com/commerce/DocumentDelivery/DDEController?Action=srchrtrv&DocNm=1773204&DocType=DS&DocLang=English; ComponentLink2Description: DigiKey Link; ComponentLink2URL: http://digikey.com/product-detail/en/te-connectivity-passive-product/CRG1206F100K/A106067CT-ND/3477717; Composition: Thick Film; Device Package: 1206 (3216 Metric); Height - Seated (Max): 0.026" (0.65mm); LastUpdated: 9/2/2020 1:13:10 AM; Lifecycle Status: Active; Minimum Order: 1; Number of Terminations: 2; Operating Temperature: -55°C ~ 155°C; Package / Case: 1206 (3216 Metric); Packaging: TapeAndReel; PartId: 26988; Part Status: Active; Price: 0.01; Resistance: 100 kOhms; Series: CRG, Neohm; Size / Dimension: 0.122" L x 0.061" W (3.10mm x 1.55mm); Supplier 1: DigiKey; Supplier Part Number 1: A106067CT-ND; Supplier Device Package: 1206; Tolerance: ±1%; Value: 100 kOhms
R19 R22 = BVT2512: SMT Resistor
U1 = LR1121B_3V3: 200mA 7V LDO; Value: 3.3V